# EAGLE design esp32 LoRa (EAGLE 9.5.2)
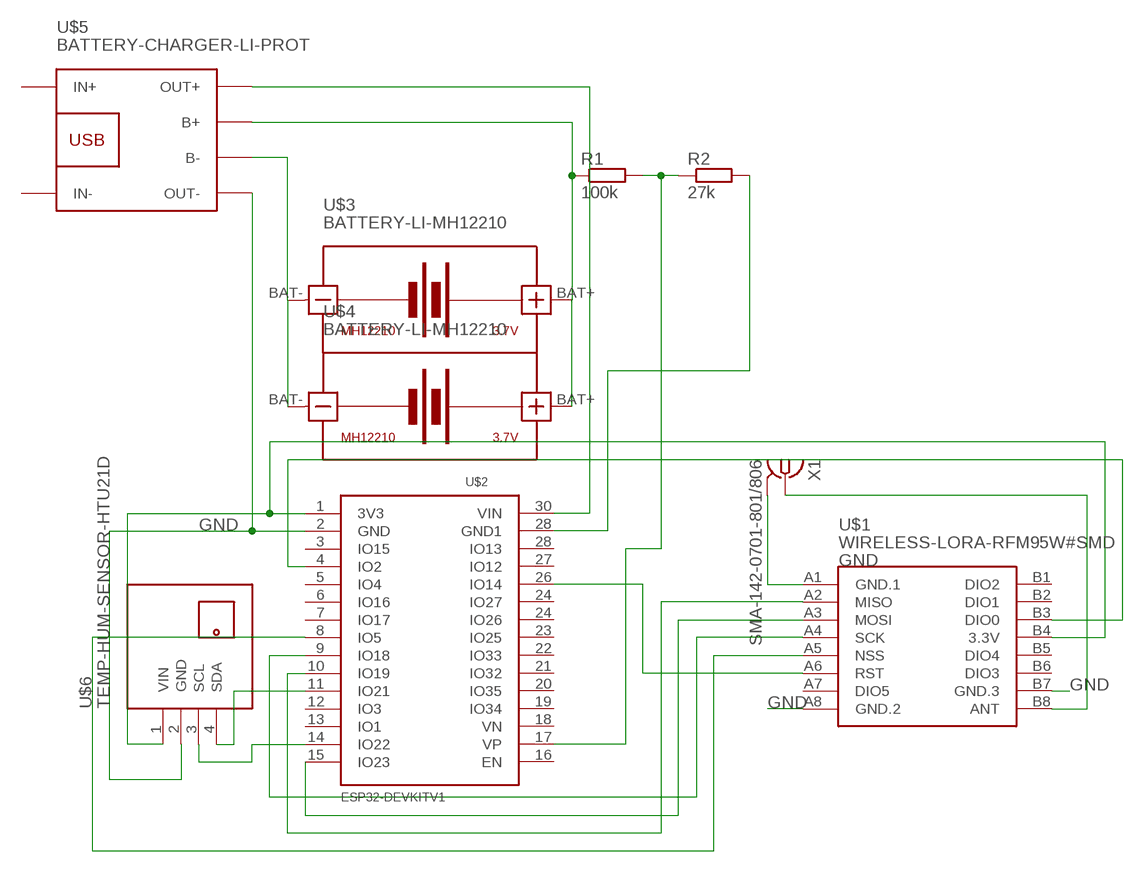
[diagram p0: schematic, sheet 1]

## Parts
R1  100k  R-EU_0204/7  [0204/7]
R2  27k  R-EU_0204/7  [0204/7]
U$1  WIRELESS-LORA-RFM95W#SMD  [WIRELESS-LORA-RFM95W#SMD]
U$2  ESP32DEVKITV1  [ESP32-DEVKITV1]
U$3  BATTERY-LI-MH12210  [BATTERY-LI-MH12210]
U$4  BATTERY-LI-MH12210  [BATTERY-LI-MH12210]
U$5  BATTERY-CHARGER-LI-PROT  [BATTERY-CHARGER-LI-PROT]
U$6  TEMP-HUM-SENSOR-HTU21D  [TEMP-HUM-SENSOR-HTU21D]
X1  SMA-142-0701-801/806  [J502-ND-142-0701-801/806]

## Nets
GND: U$1.A1(GND.1) U$1.A8(GND.2) U$1.B7(GND.3) U$2.2(GND) U$5.OUT- U$6.2(GND) X1.G@1 X1.G@2 X1.G@3 X1.G@4
N$1: U$1.B4(3.3V) U$2.1(3V3) U$6.1(VIN)
N$2: R2.2 U$2.28(GND1)
N$3: U$2.14(IO22) U$6.3(SCL)
N$4: U$2.11(IO21) U$6.4(SDA)
N$5: U$3.BAT- U$4.BAT- U$5.B-
N$6: R1.1 U$3.BAT+ U$4.BAT+ U$5.B+
N$7: U$2.30(VIN) U$5.OUT+
N$8: U$1.A2(MISO) U$2.10(IO19)
N$9: U$1.A3(MOSI) U$2.15(IO23)
N$10: U$1.A4(SCK) U$2.9(IO18)
N$11: U$1.B3(DIO0) U$2.4(IO2)
N$12: U$1.A6(RST) U$2.26(IO14)
N$13: U$1.A5(NSS) U$2.8(IO5)
N$14: U$1.B8(ANT) X1.1
N$15: R1.2 R2.1 U$2.17(VP)
Unconnected: U$1.A7(DIO5) U$1.B1(DIO2) U$1.B2(DIO1) U$1.B5(DIO4) U$1.B6(DIO3) U$2.3(IO15) U$2.5(IO4) U$2.6(IO16) U$2.7(IO17) U$2.12(IO3) U$2.13(IO1) U$2.16(EN) U$2.18(VN) U$2.19(IO34) U$2.20(IO35) U$2.21(IO32) U$2.22(IO33) U$2.23(IO25) U$2.24(IO26) U$2.24(IO27) U$2.27(IO12) U$2.28(IO13) U$5.IN+ U$5.IN-

## Library data of the parts
R1 R2 = rcl:R-EU_: RESISTOR, European symbol; SPICEPREFIX: R
U$1 = diy-modules:WIRELESS-LORA-RFM95W: 868/915 MHz LoRa Radio Transceiver Module based on SX1276 chip Click here to find device on ebay.com <http://www.ebay.com/sch/RFM95W+transceiver>
U$2 = ESP32-DEVKITV1:ESP32DEVKITV1
U$3 U$4 = diy-modules:BATTERY-LI-MH12210: Lithium-Ion MH12210 Rechargeable Battery Panasonic NCR18650PF battery datasheet available here: https://industrial.panasonic.com/cdbs/www-data/pdf2/ACI4000/ACI4000C12.pdf Click here to find device on ebay.com <http://www.ebay.com/sch/ncr18650b+battery>
U$5 = diy-modules:BATTERY-CHARGER-LI-PROT: Lithium Battery 5V Charger with protection circuit More details available here: http://www.instructables.com/id/DIY-Lithium-ion-Battery-Charger/step4/TP4056-based-lithium-ion-battery-charger-module/ Click here to find device on ebay.com <http://www.ebay.com/sch/tp4056+charger+usb+protection>
U$6 = diy-modules:TEMP-HUM-SENSOR-HTU21D: Digital Humidity & Temperature Sensor based on HTU21D device More information about HTU21D device is available here: http://futureeverything.org/wp-content/uploads/2014/05/Humidity-Datasheet.pdf HTU21D Arudino Library is available here: https://learn.sparkfun.com/tutorials/htu21d-humidity-sensor-hookup-guide/htu21d-library-and-functions Click here to find device on ebay.com <http://www.ebay.com/sch/htu21d+board>
X1 = con-coax:SMA-: SMA 50 Ohm End Launch Jack Receptacle - Round Contact Johnson Components Source: www.johnsoncomponents.com .. J502-ND.pdf; MF: JOHNSON COMPONENTS; MPN: 142-0701-801; OC_FARNELL: 1608592; OC_NEWARK: 90F2624

## Board
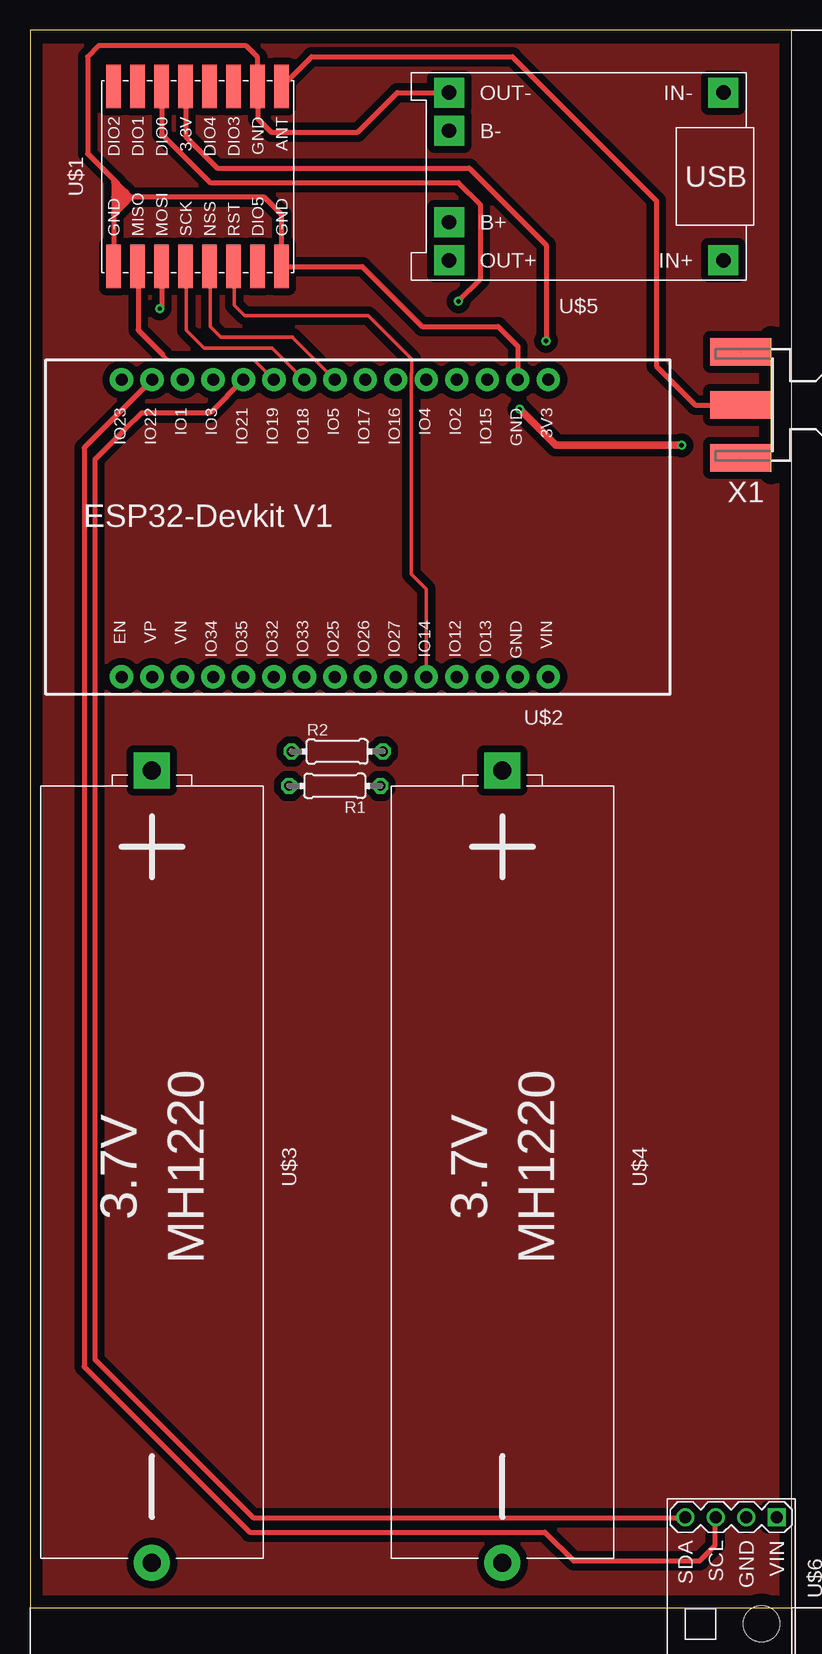
[diagram p1: board, top side]
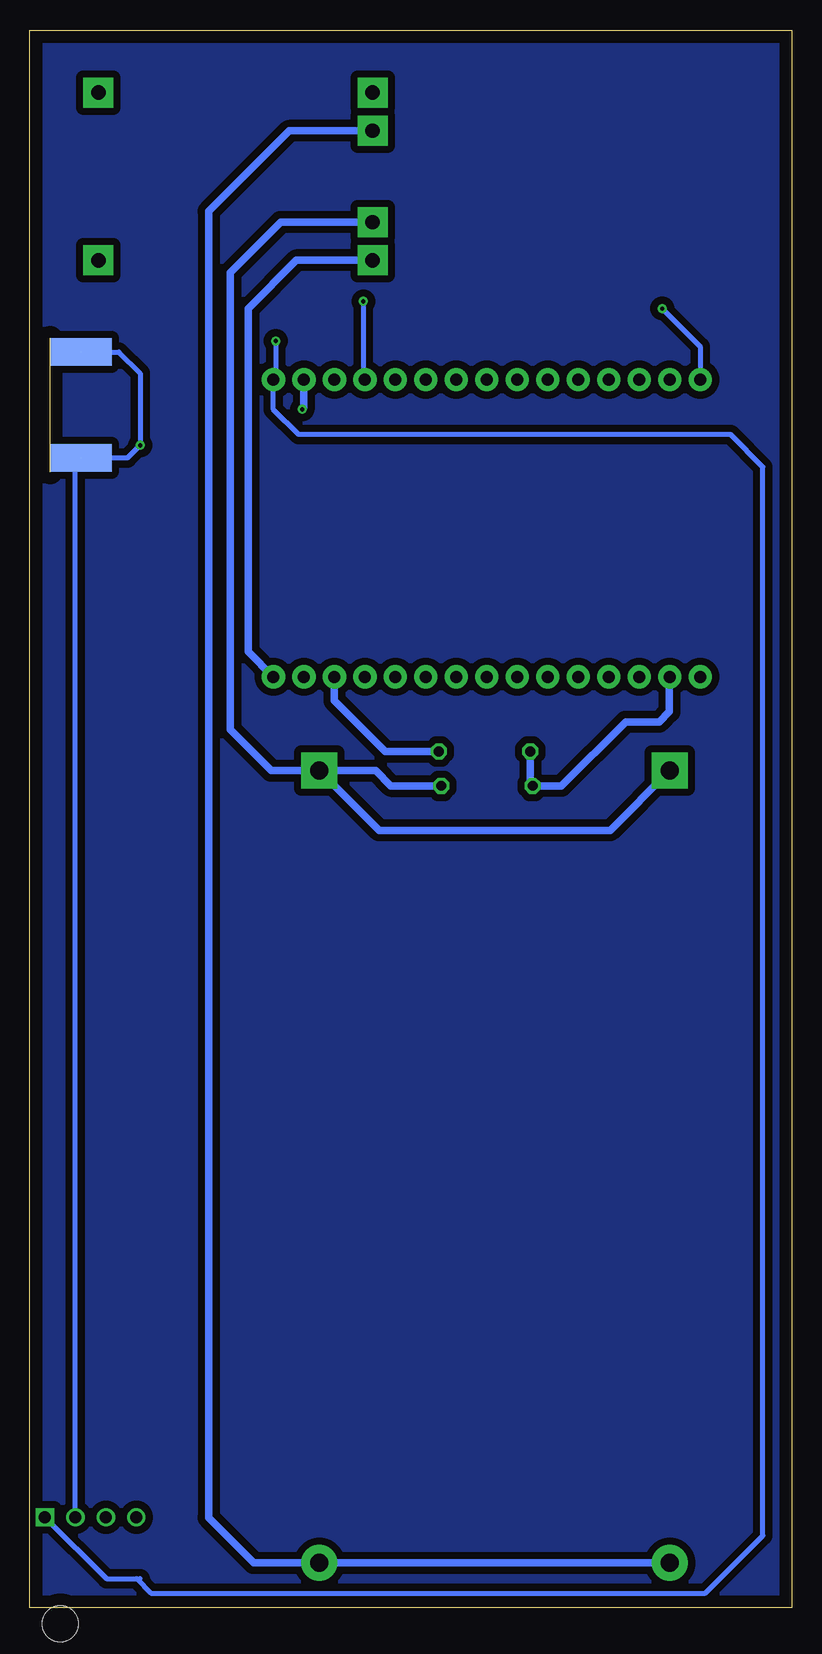
[diagram p2: board, bottom side, seen from below]

Size 63.48 x 131.52 mm. Coordinates in mm from the lower left corner, seen from the top.
Outline: 0,0 63.48,0 63.48,131.52 0,131.52 0,0
Copper layers (1*16): Top 0.035mm / dielectric 1.5mm / Bottom 0.035mm
Design rules "default": minimum track width 6mil, minimum drill 0.35mm, track to track 6mil, track to pad 6mil, pad to pad 6mil, via to via 6mil, smd to smd 6mil, copper to edge 40mil, drill to drill 6mil, minimum pad ring 10mil, minimum via ring 8mil, stop-mask expansion 4mil, vias tented up to drill 0mil, thermal gap 10mil

### Footprints (pad centres in the part's own frame; a part is rotated, then mirrored left to right if it is on the bottom)
0204/7 = drill 0.813 octagon: 1 -3.81,0; 2 3.81,0
WIRELESS-LORA-RFM95W#SMD = smd 3.6 x 1.2: A1 -7.5,7; A2 -7.5,5; A3 -7.5,3; A4 -7.5,1; A5 -7.5,-1; A6 -7.5,-3; A7 -7.5,-5; A8 -7.5,-7; B1 7.5,7; B2 7.5,5; B3 7.5,3; B4 7.5,1; B5 7.5,-1; B6 7.5,-3; B7 7.5,-5; B8 7.5,-7
ESP32-DEVKITV1 = drill 1 pad 1.93: 1 -22.87,-13.54; 2 -20.33,-13.54; 3 -17.79,-13.54; 4 -15.25,-13.54; 5 -12.71,-13.54; 6 -10.17,-13.54; 7 -7.63,-13.54; 8 -5.09,-13.54; 9 -2.55,-13.54; 10 -0.01,-13.54; 11 2.53,-13.54; 12 5.07,-13.54; 13 7.61,-13.54; 14 10.15,-13.54; 15 12.69,-13.54; 16 12.69,11.23; 17 10.15,11.23; 18 7.61,11.23; 19 5.07,11.23; 20 2.53,11.23; 21 -0.01,11.23; 22 -2.55,11.23; 23 -5.09,11.23; 24 -7.63,11.23; 25 -10.17,11.23; 26 -12.71,11.23; 27 -15.25,11.23; 28 -17.79,11.23; 29 -20.33,11.23; 30 -22.87,11.23
BATTERY-LI-MH12210 = drill 1.5 pad 3 square: BAT+ -33.02,0 | drill 1.5 pad 3: BAT- 33.02,0
BATTERY-CHARGER-LI-PROT = drill 1.2 pad 2.5 square: B+ 10.795,3.81; B- 10.795,-3.81; IN+ -12.065,6.985; IN- -12.065,-6.985; OUT+ 10.795,6.985; OUT- 10.795,-6.985
TEMP-HUM-SENSOR-HTU21D = drill 1 square: 1 -5.08,3.81 | drill 1: 2 -5.08,1.27; 3 -5.08,-1.27; 4 -5.08,-3.81 | hole 3: 3.81,2.54
J502-ND-142-0701-801/806 = smd 5.08 x 2.286: 1 2.565,0; G@1 2.565,4.42; G@2 2.565,-4.42 | smd 5.08 x 2.286 bottom: G@3 2.565,4.42; G@4 2.565,-4.42

### Placement (x,y rotation side)
R1  25.4,68.51 180 top
R2  25.6,71.38 0 top
U$1  13.97,119.31 90 top
U$2  20.32,88.83 180 top
U$3  10.16,36.76 270 top
U$4  39.37,36.76 270 top
U$5  45.72,119.31 180 top
U$6  58.42,2.47 270 top
X1  61.79,100.26 180 top

### Tracks (layer width: path | path; a pad name or v marks a point on that pad's centre or on a via)
B
  pour Bottom (isolate 0.61): 0.6,130.2 62.4,130.2 62.4,0.9 0.6,0.9
GND  (via drill 0.35)  (2 unrouted)
  Top 0.406: U$5.OUT- 30.59,126.3 27.3,123 20.1,123 18.97,124.13 U$1.B7 18.97,129.23 18,130.2 5.7,130.2 4.8,129.3 4.8,121.2 6.97,119.03 | 6.97,119.03 6.97,118.8 | 6.97,118.8 6.97,117.6 | 6.97,117.6 6.97,116.1 | 6.97,116.1 U$1.A1 | 8.4,117.6 19.5,117.6 20.97,116.13 U$1.A8 27.69,111.81 32.7,106.8 39,106.8 40.65,105.15 U$2.2 | 6.97,117.6 8.4,117.6 | 6.97,119.03 7.65,118.35 | 7.65,118.35 7.83,118.17 | 7.83,118.17 8.4,117.6 | 8.4,117.6 8.4,117.53 7.83,116.97 | 7.83,116.97 7.38,116.52 | 7.38,116.52 6.97,116.1 | 6.97,118.8 7.38,118.39 7.38,117 | 7.38,117 7.38,116.52 | 7.83,118.17 7.83,117.3 | 7.83,117.3 7.83,116.97 | 7.65,118.35 7.65,117.48 7.83,117.3 | 7.83,117.3 7.54,117 7.38,117
  Top 0.61: v40.8,99.9 43.8,96.9 v54.3,96.9
  Bottom 0.406: U$6.2 59.69,95.38 X1.G@3 55.36,95.84 v54.3,96.9 54.3,102.9 56.08,104.68 X1.G@4
  Bottom 0.61: U$2.2 40.65,100.05 v40.8,99.9
N$1  (via drill 0.35)
  Top 0.406: U$1.B4 12.97,122.63 15.6,120 36.6,120 43,113.6 v43,105.6
  Bottom 0.152: 43,102.45 U$2.1
  Bottom 0.406: v43,105.6 43,102.45 | U$6.1 57.1,2.42 54.6,2.42 | 54.6,2.42 54.3,2.42 | 54.6,2.42 53.4,1.22 7.2,1.22 2.4,6.02 2.4,95.1 5.1,97.8 41.1,97.8 43.19,99.89 U$2.1
N$2
  Bottom 0.61: U$2.28 38.11,75.61 33.88,71.38 R2.2
N$3
  Top 0.152: U$2.14 8.75,100.95 | 57,7.7 57.1,7.6 U$6.3
  Top 0.406: U$2.14 4.5,96.7 4.5,20.1 18.3,6.3 42.9,6.3 45.3,3.9 55.8,3.9 57.1,5.2 57.1,7.6
N$4
  Top 0.152: 54.75,7.45 U$6.4
  Top 0.406: U$2.11 15.02,99.6 9.3,99.6 7.95,98.25 5.4,95.7 5.4,20.7 18.6,7.5 54.7,7.5 54.75,7.45
N$5
  Bottom 0.61: U$5.B- 41.88,123.12 48.6,116.4 48.6,7.5 44.84,3.74 U$4.BAT- U$3.BAT-
N$6
  Bottom 0.61: U$3.BAT+ 15.14,64.8 34.39,64.8 U$4.BAT+ | U$4.BAT+ 34.68,69.78 33.41,68.51 R1.1 | U$5.B+ 42.6,115.5 46.8,111.3 46.8,73.2 43.38,69.78 U$4.BAT+
N$7
  Bottom 0.61: U$5.OUT+ 41.27,112.33 45.3,108.3 45.3,79.71 U$2.30
N$8
  Top 0.305: 11.1,104.4 11.5,104 18.7,104 U$2.10
  Top 0.406: U$1.A2 9,111.78 9,106.5 11.1,104.4
N$9  (via drill 0.35)
  Top 0.406: U$1.A3 10.97,108.47 v10.8,108.3
  Bottom 0.406: v10.8,108.3 7.63,105.13 U$2.15
N$10
  Top 0.152: 13,111.3 13,111.7 U$1.A4
  Top 0.305: U$2.9 22.83,102.37 20.2,105 14.5,105 13,106.5 13,111.3
N$11  (via drill 0.35)
  Top 0.406: U$1.B3 10.97,122.83 15,118.8 35.7,118.8 37.5,117 37.5,110.7 v35.7,108.9
  Bottom 0.406: v35.7,108.9 35.7,102.5 U$2.4
N$12
  Top 0.152: 31.75,102.95 31.75,98.7 | 33,77.7 U$2.26
  Top 0.305: U$1.A6 17,111.78 17,108.6 17.9,107.7 28.2,107.7 31.8,104.1 31.8,102.94 31.76,102.9 31.76,98.71 31.75,98.7 31.75,86.15 33,84.9 33,77.7
N$13
  Top 0.152: 15,110.4 15,111.7 U$1.A5
  Top 0.305: U$2.8 21.9,105.88 21.9,105.9 15.9,105.9 15,106.8 15,110.4
N$14
  Top 0.406: U$1.B8 23.46,129.3 40.2,129.3 52.2,117.3 52.2,103.5 55.44,100.26 X1.1
N$15
  Bottom 0.61: U$2.17 10.2,77.57 10.2,74.7 11.05,73.85 13.85,73.85 19.19,68.51 R1.2 21.79,68.71 R2.1
U
  pour Top (isolate 0.61): 1.2,130.2 62.4,130.2 62.4,1.2 46.2,1.2 1.2,1.2